# Altium project rffe-microcontroller.PrjPcb
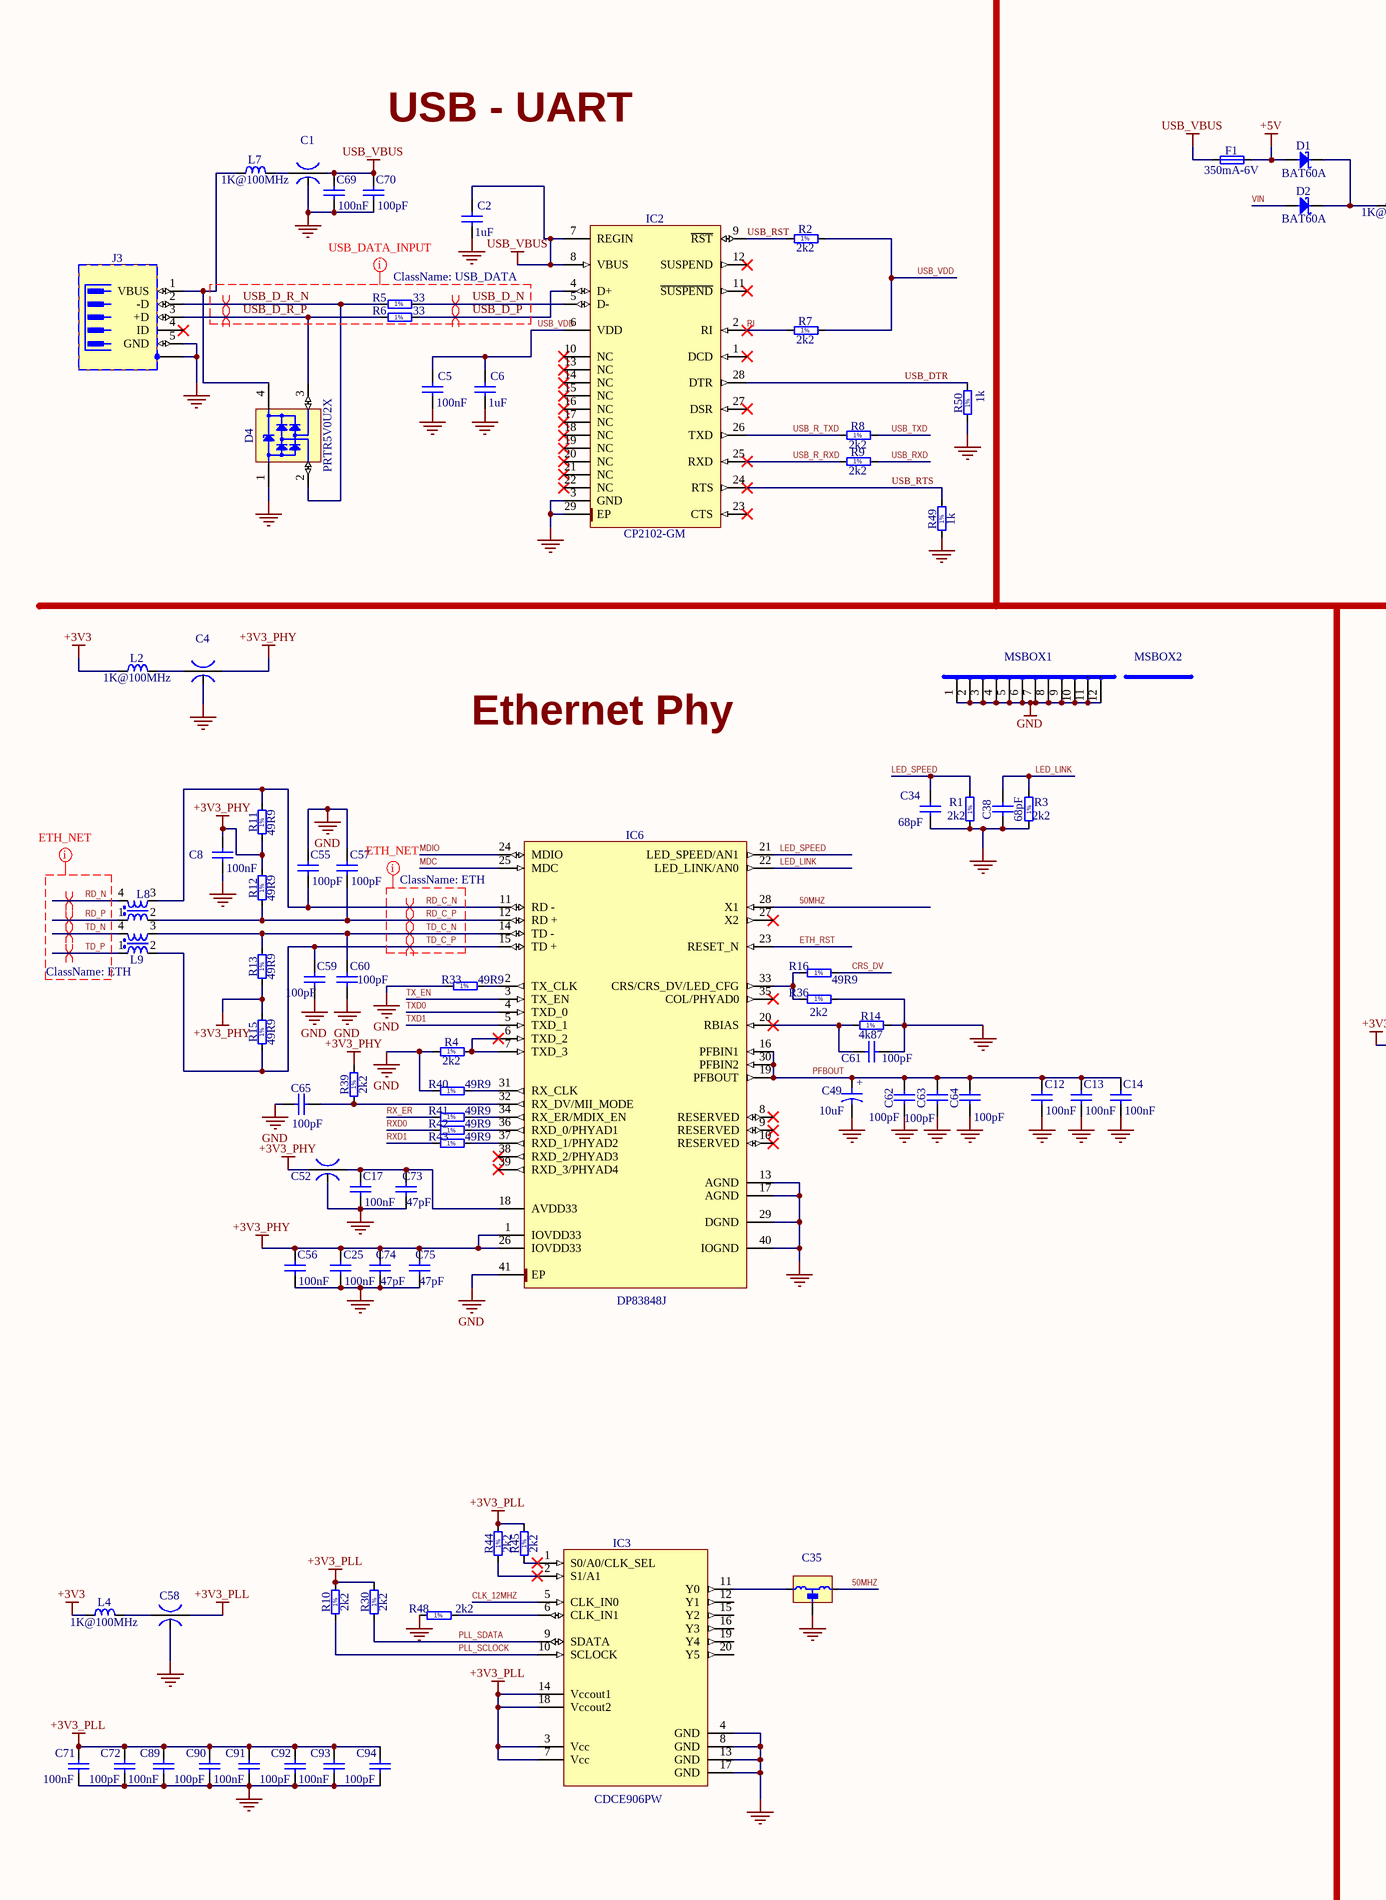
[diagram p0: rffe-microcontroller.SchDoc, left]
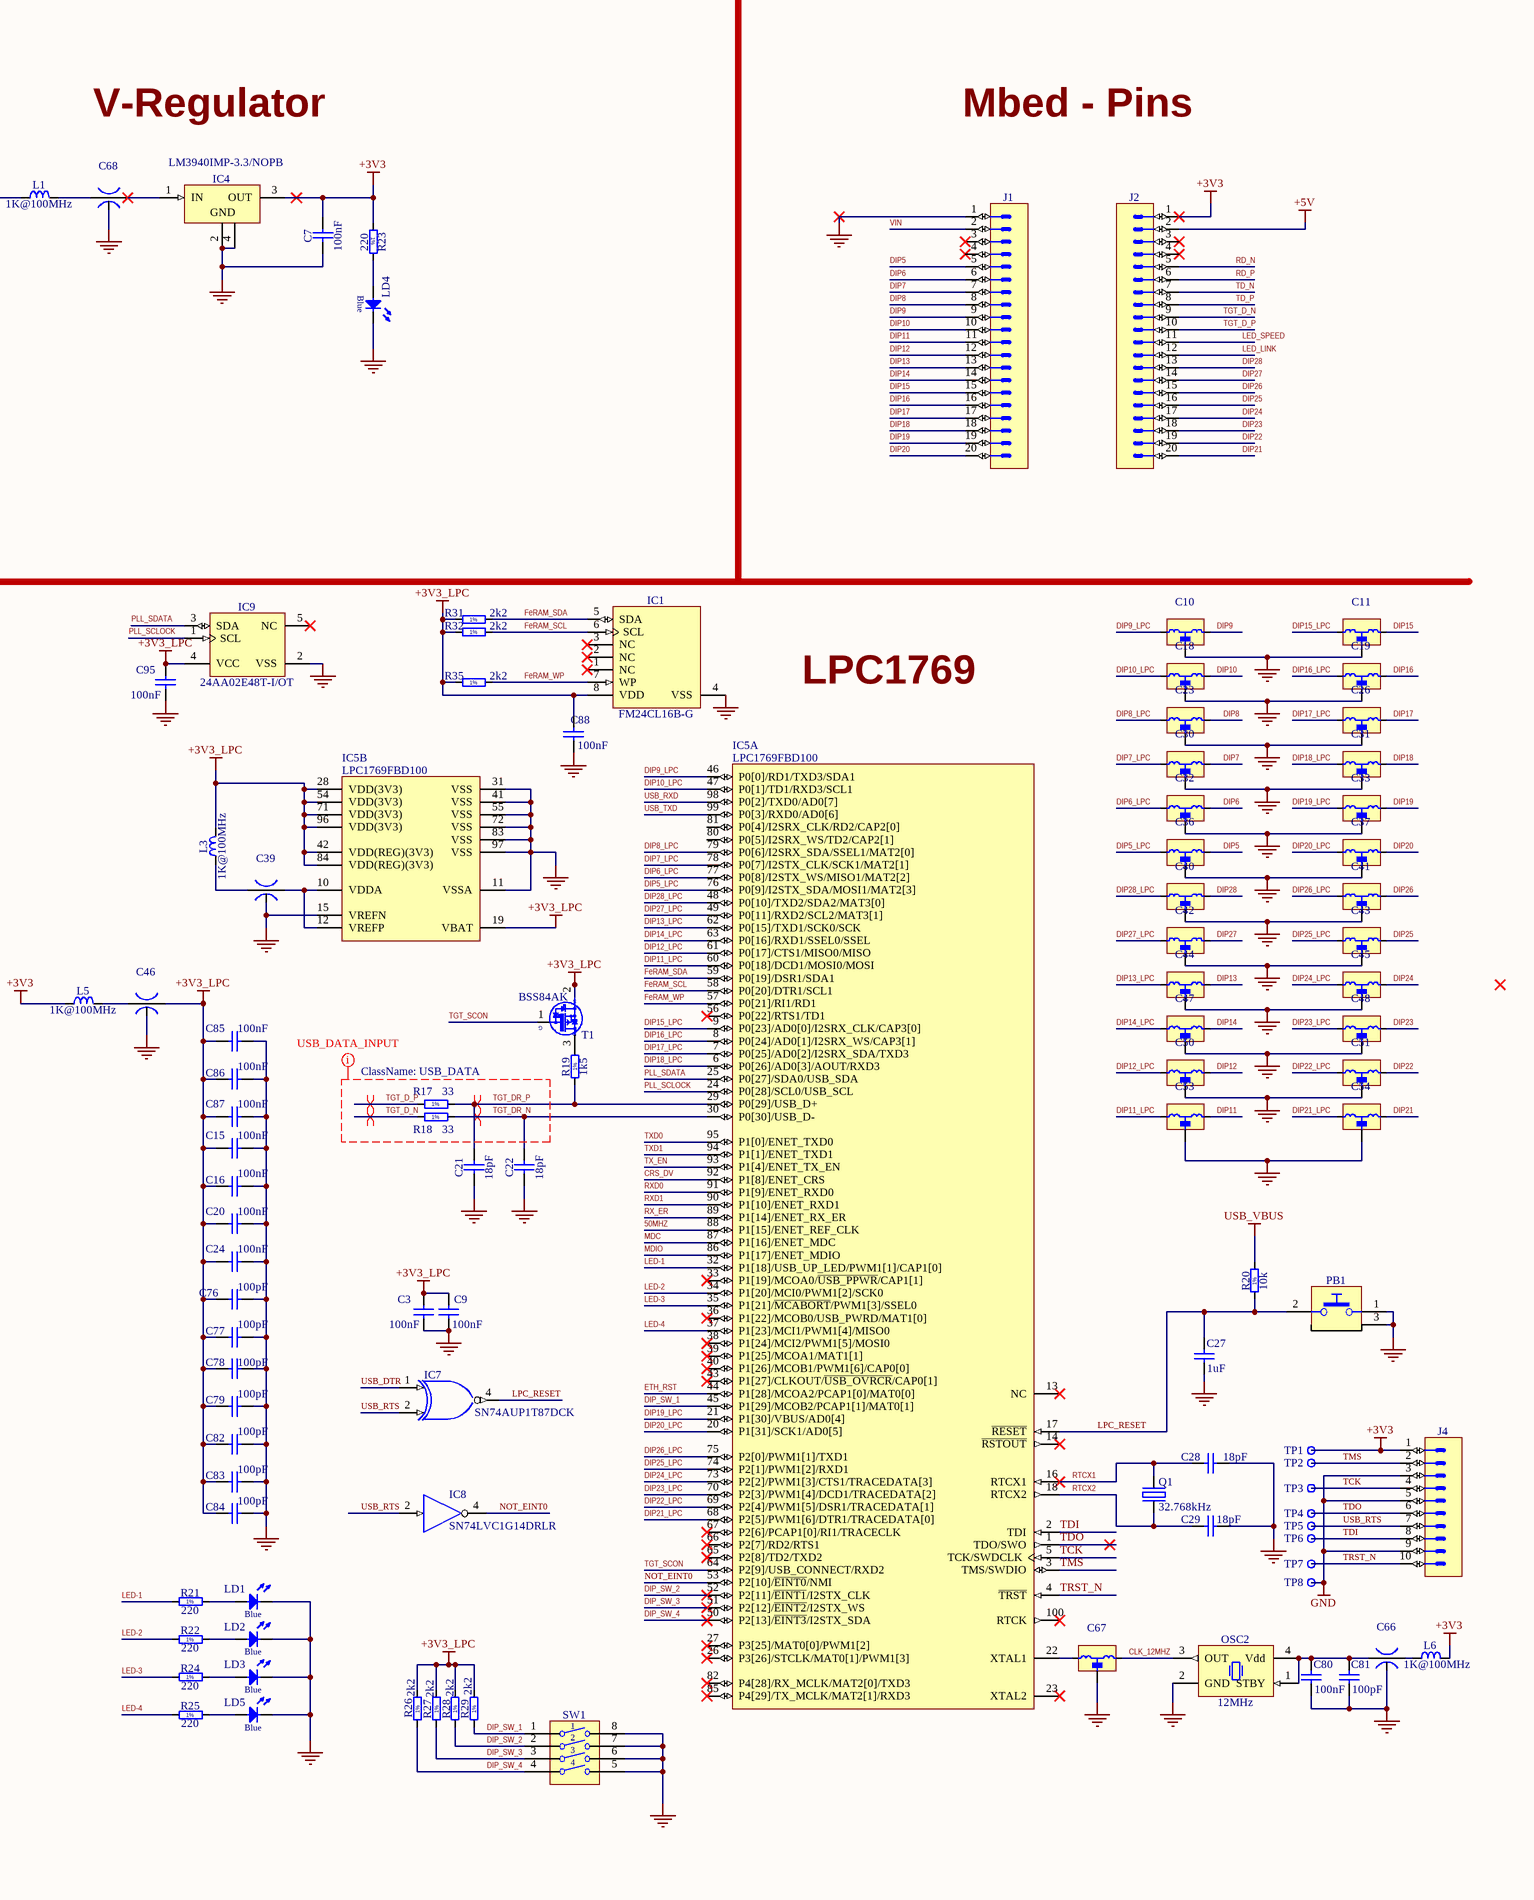
[diagram p1: rffe-microcontroller.SchDoc, right]
ProjectName: RFFE-uc; Revision: 1.1
1 sheet, 186 parts. Net scope: global (net labels, ports and power ports of the same name join across sheets).
Board file: rffe-uc.PcbDoc

## Sheet rffe-microcontroller.SchDoc
size A2; CheckedBy: Aylons; DrawnBy: Luis Fernando Avitia; Revision: 1.2; SheetTotal: 1; ProjectName: RFFE-uc

### Parts
C1  10uF  [CAPC_MURATA_NFM21PS_0805 - TOP_OVERLAY_MENOR]  (value not drawn)
C2  1uF  [CAPC1005X55N]
C3  100nF  [CAPC1005X55N]
C4  10uF  [CAPC_MURATA_NFM21PS_0805 - TOP_OVERLAY_MENOR]  (value not drawn)
C5  100nF  [CAPC1005X55N]
C6  1uF  [CAPC1005X55N]
C7  100nF  [CAPC1005X55N]
C8  100nF  [CAPC1005X55N]
C9  100nF  [CAPC1005X55N]
C10  50pF  [CAPC_MURATA_NFL18ST_UNPOLARIZED]  (value not drawn)
C11  50pF  [CAPC_MURATA_NFL18ST_UNPOLARIZED]  (value not drawn)
C12  100nF  [CAPC1005X55N]
C13  100nF  [CAPC1005X55N]
C14  100nF  [CAPC1005X55N]
C15  100nF  [CAPC1005X55N]
C16  100nF  [CAPC1005X55N]
C17  100nF  [CAPC1005X55N]
C18  50pF  [CAPC_MURATA_NFL18ST_UNPOLARIZED]  (value not drawn)
C19  50pF  [CAPC_MURATA_NFL18ST_UNPOLARIZED]  (value not drawn)
C20  100nF  [CAPC1005X55N]
C21  18pF  [CAPC1005X55N]
C22  18pF  [CAPC1005X55N]
C23  50pF  [CAPC_MURATA_NFL18ST_UNPOLARIZED]  (value not drawn)
C24  100nF  [CAPC1005X55N]
C25  100nF  [CAPC1005X55N]
C26  50pF  [CAPC_MURATA_NFL18ST_UNPOLARIZED]  (value not drawn)
C27  1uF  [CAPC1005X55N]
C28  18pF  [CAPC1005X55N]
C29  18pF  [CAPC1005X55N]
C30  50pF  [CAPC_MURATA_NFL18ST_UNPOLARIZED]  (value not drawn)
C31  50pF  [CAPC_MURATA_NFL18ST_UNPOLARIZED]  (value not drawn)
C32  50pF  [CAPC_MURATA_NFL18ST_UNPOLARIZED]  (value not drawn)
C33  50pF  [CAPC_MURATA_NFL18ST_UNPOLARIZED]  (value not drawn)
C34  68pF  [CAPC1005X55N]
C35  50pF  [CAPC_MURATA_NFL18ST_UNPOLARIZED]  (value not drawn)
C36  50pF  [CAPC_MURATA_NFL18ST_UNPOLARIZED]  (value not drawn)
C37  50pF  [CAPC_MURATA_NFL18ST_UNPOLARIZED]  (value not drawn)
C38  68pF  [CAPC1005X55N]
C39  10uF  [CAPC_MURATA_NFM21PS_0805 - TOP_OVERLAY_MENOR]  (value not drawn)
C40  50pF  [CAPC_MURATA_NFL18ST_UNPOLARIZED]  (value not drawn)
C41  50pF  [CAPC_MURATA_NFL18ST_UNPOLARIZED]  (value not drawn)
C42  50pF  [CAPC_MURATA_NFL18ST_UNPOLARIZED]  (value not drawn)
C43  50pF  [CAPC_MURATA_NFL18ST_UNPOLARIZED]  (value not drawn)
C44  50pF  [CAPC_MURATA_NFL18ST_UNPOLARIZED]  (value not drawn)
C45  50pF  [CAPC_MURATA_NFL18ST_UNPOLARIZED]  (value not drawn)
C46  10uF  [CAPC_MURATA_NFM21PS_0805 - TOP_OVERLAY_MENOR]  (value not drawn)
C47  50pF  [CAPC_MURATA_NFL18ST_UNPOLARIZED]  (value not drawn)
C48  50pF  [CAPC_MURATA_NFL18ST_UNPOLARIZED]  (value not drawn)
C49  10uF  [CAPMP3216X180N]
C50  50pF  [CAPC_MURATA_NFL18ST_UNPOLARIZED]  (value not drawn)
C51  50pF  [CAPC_MURATA_NFL18ST_UNPOLARIZED]  (value not drawn)
C52  10uF  [CAPC_MURATA_NFM21PS_0805 - TOP_OVERLAY_MENOR]  (value not drawn)
C53  50pF  [CAPC_MURATA_NFL18ST_UNPOLARIZED]  (value not drawn)
C54  50pF  [CAPC_MURATA_NFL18ST_UNPOLARIZED]  (value not drawn)
C55  100pF  [CAPC1005X55N]
C56  100nF  [CAPC1005X55N]
C57  100pF  [CAPC1005X55N]
C58  1uF  [CAPC_MURATA_NFM18PS_0603]  (value not drawn)
C59  100pF  [CAPC1005X55N]
C60  100pF  [CAPC1005X55N]
C61  100pF  [CAPC1005X55N]
C62  100pF  [CAPC1005X55N]
C63  100pF  [CAPC1005X55N]
C64  100pF  [CAPC1005X55N]
C65  100pF  [CAPC1005X55N]
C66  10uF  [CAPC_MURATA_NFM21PS_0805 - TOP_OVERLAY_MENOR]  (value not drawn)
C67  50pF  [CAPC_MURATA_NFL18ST_UNPOLARIZED]  (value not drawn)
C68  10uF  [CAPC_MURATA_NFM21PS_0805 - TOP_OVERLAY_MENOR]  (value not drawn)
C69  100nF  [CAPC1005X55N]
C70  100pF  [CAPC1005X55N]
C71  100nF  [CAPC1005X55N]
C72  100pF  [CAPC1005X55N]
C73  47pF  [CAPC1005X55N]
C74  47pF  [CAPC1005X55N]
C75  47pF  [CAPC1005X55N]
C76  100pF  [CAPC1005X55N]
C77  100pF  [CAPC1005X55N]
C78  100pF  [CAPC1005X55N]
C79  100pF  [CAPC1005X55N]
C80  100nF  [CAPC1005X55N]
C81  100pF  [CAPC1005X55N]
C82  100pF  [CAPC1005X55N]
C83  100pF  [CAPC1005X55N]
C84  100pF  [CAPC1005X55N]
C85  100nF  [CAPC1005X55N]
C86  100nF  [CAPC1005X55N]
C87  100nF  [CAPC1005X55N]
C88  100nF  [CAPC1005X55N]
C89  100nF  [CAPC1005X55N]
C90  100pF  [CAPC1005X55N]
C91  100nF  [CAPC1005X55N]
C92  100pF  [CAPC1005X55N]
C93  100nF  [CAPC1005X55N]
C94  100pF  [CAPC1005X55N]
C95  100nF  [CAPC1005X55N]
D1  BAT60A  [SOD2512X110N]
D2  BAT60A  [SOD2512X110N]
D4  PRTR5V0U2X  [SOT190P230X110-4N]
F1  350mA-6V  [FUSR_LITTELFUSE_0603L010]
IC1  FM24CL16B-G  [SOIC127P600X175-8N]
IC2  CP2102-GM  [QFN50P500X500X100-29N-S335]
IC3  CDCE906PW  [SOP65P640X120-20N]
IC4  LM3940IMP-3.3/NOPB  [SOT230P700X180-4N]
IC5  LPC1769FBD100  [QFP50P1600X1600X160-100N]  (parts A,B of 2)
IC6  DP83848J  [QFN50P600X600X80-41N-S460_S/VIAS]
IC7  SN74AUP1T87DCK  [SOT65P210X110-5N]
IC8  SN74LVC1G14DRLR  [SOTFL50P160X60-5N]
IC9  24AA02E48T-I/OT  [SOT95P280X145-5N]
J1  (no value)  [TYCO_2-87224-0]
J2  (no value)  [TYCO_2-87224-0]
J3  (no value)  [HIROSE-ZX62D-AB-5P8(30)]
J4  (no value)  [SAMTEC_FTSH-105-01-L-DV-K]
L1  1K@100MHz  [INDC1608X95N]
L2  1K@100MHz  [INDC1608X95N]
L3  1K@100MHz  [INDC1608X95N]
L4  1K@100MHz  [INDC1608X95N]
L5  1K@100MHz  [INDC1608X95N]
L6  1K@100MHz  [INDC1608X95N]
L7  1K@100MHz  [INDC1608X95N]
L8  200uH  [IND_MURATA_DLW43MH]  (value not drawn)
L9  200uH  [IND_MURATA_DLW43MH]  (value not drawn)
LD1  (no value)  [LED_LITEON_LTST-C150TBKT]
LD2  (no value)  [LED_LITEON_LTST-C150TBKT]
LD3  (no value)  [LED_LITEON_LTST-C150TBKT]
LD4  (no value)  [LED_LITEON_LTST-C150TBKT]
LD5  (no value)  [LED_LITEON_LTST-C150TBKT]
MSBOX1  (no value)  [MSBOX_WURTH_36103205]
MSBOX2  (no value)  [MSBOX_WURTH_36003200]
OSC2  12MHz  [XTAL_CONNOR_CS_LNLS]
PB1  (no value)  [PB_OMRON_B3U-1100P]
Q1  32.768kHz  [XTAL_ABRACON_ABS06]
R1  2k2  [RESC1005X40N]
R2  2k2  [RESC1005X40N]
R3  2k2  [RESC1005X40N]
R4  2k2  [RESC1005X40N]
R5  33  [RESC1005X40N]
R6  33  [RESC1005X40N]
R7  2k2  [RESC1005X40N]
R8  2k2  [RESC1005X40N]
R9  2k2  [RESC1005X40N]
R10  2k2  [RESC1005X40N]
R11  49R9  [RESC1005X40N]
R12  49R9  [RESC1005X40N]
R13  49R9  [RESC1005X40N]
R14  4k87  [RESC1005X40N]
R15  49R9  [RESC1005X40N]
R16  49R9  [RESC1005X40N]
R17  33  [RESC1005X40N]
R18  33  [RESC1005X40N]
R19  1k5  [RESC1005X40N]
R20  10k  [RESC1005X40N]
R21  220  [RESC1005X40N]
R22  220  [RESC1005X40N]
R23  220  [RESC1005X40N]
R24  220  [RESC1005X40N]
R25  220  [RESC1005X40N]
R26  2k2  [RESC1005X40N]
R27  2k2  [RESC1005X40N]
R28  2k2  [RESC1005X40N]
R29  2k2  [RESC1005X40N]
R30  2k2  [RESC1005X40N]
R31  2k2  [RESC1005X40N]
R32  2k2  [RESC1005X40N]
R33  49R9  [RESC1005X40N]
R35  2k2  [RESC1005X40N]
R36  2k2  [RESC1005X40N]
R39  2k2  [RESC1005X40N]
R40  49R9  [RESC1005X40N]
R41  49R9  [RESC1005X40N]
R42  49R9  [RESC1005X40N]
R43  49R9  [RESC1005X40N]
R44  2k2  [RESC1005X40N]
R45  2k2  [RESC1005X40N]
R48  2k2  [RESC1005X40N]
R49  1k  [RESC1005X40N]
R50  1k  [RESC1005X40N]
SW1  (no value)  [SW_TYCO_1571983-4]
T1  BSS84AK  [SOT95P230X110-3N]
TP1  (no value)  [TPR120]
TP2  (no value)  [TPR120]
TP3  (no value)  [TPR120]
TP4  (no value)  [TPR120]
TP5  (no value)  [TPR120]
TP6  (no value)  [TPR120]
TP7  (no value)  [TPR120]
TP8  (no value)  [TPR120]

### Nets
+3V3: C7.2 IC4.3(OUT) J2.1 J4.1 L2.1 L4.1 L5.1 L6.2 R23.1 TP1.1
+3V3_LPC: C3.1 C9.1 C15.1 C16.1 C20.1 C24.1 C46.3 C76.2 C77.2 C78.2 C79.2 C82.2 C83.2 C84.2 C85.1 C86.1 C87.1 C88.2 C95.1 IC1.8(VDD) IC5.19(VBAT) IC5.28(VDD(3V3)) IC5.42(VDD(REG)(3V3)) IC5.54(VDD(3V3)) IC5.71(VDD(3V3)) IC5.84(VDD(REG)(3V3)) IC5.96(VDD(3V3)) IC7.5(+3V3_LPC) IC8.5(VCC) IC9.4(VCC) L3.2 R26.2 R27.2 R28.2 R29.2 R31.1 R32.1 R35.1 T1.2(S)
+3V3_PHY: C4.3 C8.1 C25.1 C52.1 C56.1 C74.2 C75.2 IC6.1(IOVDD33) IC6.26(IOVDD33) R11.1 R12.2 R13.1 R15.2 R39.2
+3V3_PLL: C58.1 C71.1 C72.2 C89.1 C90.2 C91.1 C92.2 C93.1 C94.2 IC3.3(Vcc) IC3.7(Vcc) IC3.14(Vccout1) IC3.18(Vccout2) R10.2 R30.2 R44.2 R45.2
+5V: D1.2(A) F1.2 J2.2
GND: C1.2 C2.1 C3.2 C4.2 C5.2 C6.1 C7.1 C8.2 C9.2 C10.2 C11.2 C12.2 C13.2 C14.2 C15.2 C16.2 C17.2 C18.2 C19.2 C20.2 C21.1 C22.1 C23.2 C24.2 C25.2 C26.2 C27.2 C28.2 C29.2 C30.2 C31.2 C32.2 C33.2 C34.1 C35.2 C36.2 C37.2 C38.1 C39.2 C40.2 C41.2 C42.2 C43.2 C44.2 C45.2 C46.2 C47.2 C48.2 C49.2 C50.2 C51.2 C52.2 C53.2 C54.2 C55.2 C56.2 C57.2 C58.2 C59.1 C60.1 C61.2 C62.1 C63.1 C64.1 C65.1 C66.2 C67.2 C68.2 C69.2 C70.1 C71.2 C72.1 C73.1 C74.1 C75.1 C76.1 C77.1 C78.1 C79.1 C80.2 C81.1 C82.1 C83.1 C84.1 C85.2 C86.2 C87.2 C88.1 C89.2 C90.1 C91.2 C92.1 C93.2 C94.1 C95.2 D4.1(GND) IC1.4(VSS) IC2.3(GND) IC2.29(EP) IC3.4(GND) IC3.8(GND) IC3.13(GND) IC3.17(GND) IC4.2(GND) IC4.4(GND) IC5.11(VSSA) IC5.15(VREFN) IC5.31(VSS) IC5.41(VSS) IC5.55(VSS) IC5.72(VSS) IC5.83(VSS) IC5.97(VSS) IC6.13(AGND) IC6.17(AGND) IC6.29(DGND) IC6.40(IOGND) IC6.41(EP) IC7.3(GND) IC8.3(GND) IC9.2(VSS) J1.1 J3.5(GND) J3.6(SH) J4.3 J4.5 J4.9 LD1.1(C) LD2.1(C) LD3.1(C) LD4.1(C) LD5.1(C) MSBOX1.1 MSBOX1.2 MSBOX1.3 MSBOX1.4 MSBOX1.5 MSBOX1.6 MSBOX1.7 MSBOX1.8 MSBOX1.9 MSBOX1.10 MSBOX1.11 MSBOX1.12 OSC2.2(GND) PB1.1 PB1.3 R1.1 R3.1 R4.1 R14.2 R33.1 R36.2 R40.1 R48.1 R49.1 R50.1 SW1.5 SW1.6 SW1.7 SW1.8 TP8.1
USB_VBUS: C1.3 C2.2 C69.1 C70.2 F1.1 IC2.7(REGIN) IC2.8(VBUS) R20.2
50MHZ: C35.3 IC5.88(P1[15]/ENET_REF_CLK) IC6.28(X1)
CLK_12MHZ: C67.3 IC3.5(CLK_IN0) OSC2.3(OUT)
CRS_DV: IC5.92(P1[8]/ENET_CRS) R16.2
DIP5: C36.3 J1.5
DIP5_LPC: C36.1 IC5.76(P0[9]/I2STX_SDA/MOSI1/MAT2[3])
DIP6: C32.3 J1.6
DIP6_LPC: C32.1 IC5.77(P0[8]/I2STX_WS/MISO1/MAT2[2])
DIP7: C30.3 J1.7
DIP7_LPC: C30.1 IC5.78(P0[7]/I2STX_CLK/SCK1/MAT2[1])
DIP8: C23.3 J1.8
DIP8_LPC: C23.1 IC5.79(P0[6]/I2SRX_SDA/SSEL1/MAT2[0])
DIP9: C10.3 J1.9
DIP9_LPC: C10.1 IC5.46(P0[0]/RD1/TXD3/SDA1)
DIP10: C18.3 J1.10
DIP10_LPC: C18.1 IC5.47(P0[1]/TD1/RXD3/SCL1)
DIP11: C53.3 J1.11
DIP11_LPC: C53.1 IC5.60(P0[18]/DCD1/MOSI0/MOSI)
DIP12: C50.3 J1.12
DIP12_LPC: C50.1 IC5.61(P0[17]/CTS1/MISO0/MISO)
DIP13: C44.3 J1.13
DIP13_LPC: C44.1 IC5.62(P0[15]/TXD1/SCK0/SCK)
DIP14: C47.3 J1.14
DIP14_LPC: C47.1 IC5.63(P0[16]/RXD1/SSEL0/SSEL)
DIP15: C11.3 J1.15
DIP15_LPC: C11.1 IC5.9(P0[23]/AD0[0]/I2SRX_CLK/CAP3[0])
DIP16: C19.3 J1.16
DIP16_LPC: C19.1 IC5.8(P0[24]/AD0[1]/I2SRX_WS/CAP3[1])
DIP17: C26.3 J1.17
DIP17_LPC: C26.1 IC5.7(P0[25]/AD0[2]/I2SRX_SDA/TXD3)
DIP18: C31.3 J1.18
DIP18_LPC: C31.1 IC5.6(P0[26]/AD0[3]/AOUT/RXD3)
DIP19: C33.3 J1.19
DIP19_LPC: C33.1 IC5.21(P1[30]/VBUS/AD0[4])
DIP20: C37.3 J1.20
DIP20_LPC: C37.1 IC5.20(P1[31]/SCK1/AD0[5])
DIP21: C54.3 J2.20
DIP21_LPC: C54.1 IC5.68(P2[5]/PWM1[6]/DTR1/TRACEDATA[0])
DIP22: C51.3 J2.19
DIP22_LPC: C51.1 IC5.69(P2[4]/PWM1[5]/DSR1/TRACEDATA[1])
DIP23: C48.3 J2.18
DIP23_LPC: C48.1 IC5.70(P2[3]/PWM1[4]/DCD1/TRACEDATA[2])
DIP24: C45.3 J2.17
DIP24_LPC: C45.1 IC5.73(P2[2]/PWM1[3]/CTS1/TRACEDATA[3])
DIP25: C43.3 J2.16
DIP25_LPC: C43.1 IC5.74(P2[1]/PWM1[2]/RXD1)
DIP26: C41.3 J2.15
DIP26_LPC: C41.1 IC5.75(P2[0]/PWM1[1]/TXD1)
DIP27: C42.3 J2.14
DIP27_LPC: C42.1 IC5.49(P0[11]/RXD2/SCL2/MAT3[1])
DIP28: C40.3 J2.13
DIP28_LPC: C40.1 IC5.48(P0[10]/TXD2/SDA2/MAT3[0])
DIP_SW_1: IC5.45(P1[29]/MCOB2/PCAP1[1]/MAT0[1]) R29.1 SW1.1
DIP_SW_2: IC5.52(P2[11]/~{EINT1}/I2STX_CLK) R28.1 SW1.2
DIP_SW_3: IC5.51(P2[12]/~{EINT2}/I2STX_WS) R27.1 SW1.3
DIP_SW_4: IC5.50(P2[13]/~{EINT3}/I2STX_SDA) R26.1 SW1.4
ETH_RST: IC5.44(P1[28]/MCOA2/PCAP1[0]/MAT0[0]) IC6.23(RESET_N)
FeRAM_SCL: IC1.6(SCL) IC5.58(P0[20]/DTR1/SCL1) R32.2
FeRAM_SDA: IC1.5(SDA) IC5.59(P0[19]/DSR1/SDA1) R31.2
FeRAM_WP: IC1.7(WP) IC5.57(P0[21]/RI1/RD1) R35.2
LED-1: IC5.32(P1[18]/USB_UP_LED/PWM1[1]/CAP1[0]) R21.1
LED-2: IC5.34(P1[20]/MCI0/PWM1[2]/SCK0) R22.1
LED-3: IC5.35(P1[21]/~{MCABORT}/PWM1[3]/SSEL0) R24.1
LED-4: IC5.37(P1[23]/MCI1/PWM1[4]/MISO0) R25.1
LED_LINK: C38.2 IC6.22(LED_LINK/AN0) J2.12 R3.2
LED_SPEED: C34.2 IC6.21(LED_SPEED/AN1) J2.11 R1.2
LPC_RESET: C27.1 IC5.17(~{RESET}) IC7.4(Y) PB1.2 R20.1
MDC: IC5.87(P1[16]/ENET_MDC) IC6.25(MDC)
MDIO: IC5.86(P1[17]/ENET_MDIO) IC6.24(MDIO)
NOT_EINT0: IC5.53(P2[10]/~{EINT0}/NMI) IC8.4(OUT)
PFBOUT: C12.1 C13.1 C14.1 C49.1 C62.2 C63.2 C64.2 IC6.16(PFBIN1) IC6.19(PFBOUT) IC6.30(PFBIN2)
PLL_SCLOCK: IC3.10(SCLOCK) IC5.24(P0[28]/SCL0/USB_SCL) IC9.1(SCL) R10.1
PLL_SDATA: IC3.9(SDATA) IC5.25(P0[27]/SDA0/USB_SDA) IC9.3(SDA) R30.1
RD_C_N: C55.1 IC6.11(RD_-) L8.3 R11.2
RD_C_P: C57.1 IC6.12(RD_+) L8.2 R12.1
RD_N: J2.5 L8.4
RD_P: J2.6 L8.1
RI: IC2.2(RI) R7.1
RTCX1: C28.1 IC5.16(RTCX1) Q1.2(OSC2)
RTCX2: C29.1 IC5.18(RTCX2) Q1.1(OSC1)
RX_ER: IC5.89(P1[14]/ENET_RX_ER) R41.1
RXD0: IC5.91(P1[9]/ENET_RXD0) R42.1
RXD1: IC5.90(P1[10]/ENET_RXD1) R43.1
TCK: IC5.5(TCK/SWDCLK) J4.4 TP3.1
TD_C_N: C60.2 IC6.14(TD_-) L9.3 R13.2
TD_C_P: C59.2 IC6.15(TD_+) L9.2 R15.1
TD_N: J2.7 L9.4
TD_P: J2.8 L9.1
TDI: IC5.2(TDI) J4.8 TP6.1
TDO: IC5.1(TDO/SWO) J4.6 TP4.1
TGT_D_N: J2.9 R18.1
TGT_D_P: J2.10 R17.1
TGT_DR_N: C22.2 IC5.30(P0[30]/USB_D-) R18.2
TGT_DR_P: C21.2 IC5.29(P0[29]/USB_D+) R17.2 R19.1
TGT_SCON: IC5.64(P2[9]/USB_CONNECT/RXD2) T1.1(G)
TMS: IC5.3(TMS/SWDIO) J4.2 TP2.1
TRST_N: IC5.4(~{TRST}) J4.10 TP7.1
TX_EN: IC5.93(P1[4]/ENET_TX_EN) IC6.3(TX_EN)
TXD0: IC5.95(P1[0]/ENET_TXD0) IC6.4(TXD_0)
TXD1: IC5.94(P1[1]/ENET_TXD1) IC6.5(TXD_1)
USB_D_N: IC2.5(D-) R5.2
USB_D_P: IC2.4(D+) R6.2
USB_D_R_N: D4.2(I/O1) J3.2(-D) R5.1
USB_D_R_P: D4.3(I/O2) J3.3(+D) R6.1
USB_DTR: IC2.28(DTR) IC7.1(A) R50.2
USB_R_RXD: IC2.25(RXD) R9.1
USB_R_TXD: IC2.26(TXD) R8.1
USB_RST: IC2.9(~{RST}) R2.1
USB_RTS: IC2.24(RTS) IC7.2(B) IC8.2(IN) J4.7 R49.2 TP5.1
USB_RXD: IC5.98(P0[2]/TXD0/AD0[7]) R9.2
USB_TXD: IC5.99(P0[3]/RXD0/AD0[6]) R8.2
USB_VDD: C5.1 C6.2 IC2.6(VDD) R2.2 R7.2
VIN: D2.2(A) J1.2
NetC1_1: C1.1 L7.2
NetC4_1: C4.1 L2.2
NetC17_1: C17.1 C52.3 C73.2 IC6.18(AVDD33)
NetC35_1: C35.1 IC3.11(Y0)
NetC39_1: C39.1 L3.1
NetC39_3: C39.3 IC5.10(VDDA) IC5.12(VREFP)
NetC46_1: C46.1 L5.2
NetC58_3: C58.3 L4.2
NetC61_1: C61.1 IC6.20(RBIAS) R14.1
NetC65_2: C65.2 IC6.32(RX_DV/MII_MODE) R39.1
NetC66_1: C66.1 C80.1 C81.2 OSC2.1(STBY) OSC2.4(Vdd)
NetC66_3: C66.3 L6.1
NetC67_1: C67.1 IC5.22(XTAL1)
NetC68_1: C68.1 L1.2
NetC68_3: C68.3 IC4.1(IN)
NetD1_1: D1.1(C) D2.1(C) L1.1
NetD4_4: D4.4(VCC) J3.1(VBUS) L7.1
NetIC3_1: IC3.1(S0/A0/CLK_SEL) R45.1
NetIC3_2: IC3.2(S1/A1) R44.1
NetIC3_6: IC3.6(CLK_IN1) R48.2
NetIC6_2: IC6.2(TX_CLK) R33.2
NetIC6_6: IC6.6(TXD_2) IC6.7(TXD_3) R4.2
NetIC6_31: IC6.31(RX_CLK) R40.2
NetIC6_33: IC6.33(CRS/CRS_DV/LED_CFG) R16.1 R36.1
NetIC6_34: IC6.34(RX_ER/MDIX_EN) R41.2
NetIC6_36: IC6.36(RXD_0/PHYAD1) R42.2
NetIC6_37: IC6.37(RXD_1/PHYAD2) R43.2
NetLD1_2: LD1.2(A) R21.2
NetLD2_2: LD2.2(A) R22.2
NetLD3_2: LD3.2(A) R24.2
NetLD4_2: LD4.2(A) R23.2
NetLD5_2: LD5.2(A) R25.2
NetR19_2: R19.2 T1.3(D)

Not connected (* = marked no-connect by the designer): IC1 1(NC)* 2(NC)* 3(NC)*; IC2 1(DCD)* 10(NC)* 11(~{SUSPEND})* 12(SUSPEND)* 13(NC)* 14(NC)* 15(NC)* 16(NC)* 17(NC)* 18(NC)* 19(NC)* 20(NC)* 21(NC)* 22(NC)* 23(CTS)* 27(DSR)*; IC3 12(Y1) 15(Y2) 16(Y3) 19(Y4) 20(Y5); IC5 13(NC)* 14(~{RSTOUT})* 23(XTAL2)* 26(P3[26]/STCLK/MAT0[1]/PWM1[3])* 27(P3[25]/MAT0[0]/PWM1[2])* 33(P1[19]/MCOA0/~{USB_PPWR}/CAP1[1])* 36(P1[22]/MCOB0/USB_PWRD/MAT1[0])* 38(P1[24]/MCI2/PWM1[5]/MOSI0)* 39(P1[25]/MCOA1/MAT1[1])* 40(P1[26]/MCOB1/PWM1[6]/CAP0[0])* 43(P1[27]/CLKOUT/~{USB_OVRCR}/CAP0[1])* 56(P0[22]/RTS1/TD1)* 65(P2[8]/TD2/TXD2)* 66(P2[7]/RD2/RTS1)* 67(P2[6]/PCAP1[0]/RI1/TRACECLK)* 80(P0[5]/I2SRX_WS/TD2/CAP2[1]) 81(P0[4]/I2SRX_CLK/RD2/CAP2[0]) 82(P4[28]/RX_MCLK/MAT2[0]/TXD3)* 85(P4[29]/TX_MCLK/MAT2[1]/RXD3)* 100(RTCK)*; IC6 8(RESERVED)* 9(RESERVED)* 10(RESERVED)* 27(X2)* 35(COL/PHYAD0)* 38(RXD_2/PHYAD3)* 39(RXD_3/PHYAD4)*; IC9 5(NC)*; J1 3* 4*; J2 3* 4*; J3 4(ID)*

### Layout directives
differential pair: RD_C_N, RD_C_P, RD_N, RD_P, TD_C_N, TD_C_P, TD_N, TD_P, TGT_D_N, TGT_D_P, TGT_DR_N, TGT_DR_P, USB_D_N, USB_D_P, USB_D_R_N, USB_D_R_P
net class USB_DATA: TGT_D_N, TGT_D_P, TGT_DR_N, TGT_DR_P, USB_D_N, USB_D_P, USB_D_R_N, USB_D_R_P
net class ETH: RD_C_N, RD_C_P, RD_N, RD_P, TD_C_N, TD_C_P, TD_N, TD_P

### Notes on the sheet
- USB - UART
- V-Regulator
- Mbed - Pins
- Ethernet Phy
- LPC1769
- Title:
- Date:
- Project:
- Drawn by:
- Time:
- Version:
- Sheet
- Reviewed by:
- of
- Grupo de diagnóstico do feixe -
  DIG - LNLS
- File:
- Copyright CNPEM 2020.
  This source describes Open Hardware and is licensed under the CERN-OHL-S v2
  You may redistribute and modify this documentation and make products using it under the terms of the CERN-OHL-S v2 (https:/cern.ch/cern-ohl). This documentation is distributed WITHOUT ANY EXPRESS OR IMPLIED WARRANTY, INCLUDING OF MERCHANTABILITY, SATISFACTORY QUALITY AND FITNESS FOR A PARTICULAR PURPOSE. Please see the CERN-OHL-S v2 for applicable conditions.
- (in symbol CTE3216-18_10UF_16V_20%_AVX_TCJ) +
- (in symbol R0402_1K5_1%_0.0625W_100PPM) 1%
- (in symbol R0402_1K_1%_0.0625W_100PPM) 1%
- (in symbol R0402_2K2_1%_0.0625W_100PPM) 1%
- (in symbol R0402_4K87_1%_0.0625W_100PPM) 1%
- (in symbol R0402_10K_1%_0.0625W_100PPM) 1%
- (in symbol R0402_33R_1%_0.0625W_100PPM) 1%
- (in symbol R0402_49R9_1%_0.0625W_100PPM) 1%
- (in symbol R0402_220R_1%_0.0625W_100PPM) 1%

### Library data of the parts
C1 C4 C39 C46 C52 C66 C68 = CEMIF_10UF_6.3V_MURATA_NFM21PS106B0J3D_TOP_OVERLAY_MENOR: EMI Filter - Capacitor Type 1; Part Description: 4A EMI Filter Capacitor Type, NFM21PS Series (0805 Size); Manufacturer: MURATA; Voltage: 6.3V; Tolerance: ±20%; Part Number: CEMIF_10UF_6.3V_MURATA_NFM21PS106B0J3D_TOP_OVERLAY_MENOR; Component Kind: Standard; Component Type: Standard; Pin Count: 4; Value: 10uF; Status: None; Manufacturer Part Number: NFM21PS106B0J3D; Case: 0805; Mounted: Yes; Socket: No; SMD: Yes; Sense: No; ComponentHeight: 0.85; Author: LNLS DIG LOS; CreateDate: 04/12/2017; LatestRevisionDate: 04/12/2017
C2 C6 C27 = CC0402_1UF_16V_10%_X5R: Non-polarised capacitor; Part Description: SMD Multilayer Chip Ceramic Capacitor; Manufacturer: GENERIC; Manufacturer1 Part Number: C1005X5R1C105KT; Voltage: 16V; TC: X5R; Tolerance: ±10%; Part Number: CC0402_1UF_16V_10%_X5R; Component Kind: Standard; Component Type: Standard; Pin Count: 2; Value: 1uF; Status: Preferred; Manufacturer Part Number: CC0402_1UF_16V_10%_X5R; Case: 0402; Mounted: Yes; Socket: No; SMD: Yes; Sense: No; Manufacturer1 Example: TDK; Manufacturer1 ComponentHeight: 0.55mm; HelpURL: \\cern.ch\dfs\Applications\Altium\Datasheets\CC0402_X5R_TDK_C.pdf; Author: CERN DEM JLC; CreateDate: 25/10/2012; LatestRevisionDate: 25/10/2012
C3 C5 C7-C9 C12-C17 C20 C24 C25 C56 C69 C71 C80 C85-C89 C91 C93 C95 = CC0402_100NF_16V_10%_X5R: Non-polarised capacitor; Part Description: SMD Multilayer Chip Ceramic Capacitor; Manufacturer: GENERIC; Manufacturer1 Part Number: GRM155R61C104KA88D; Voltage: 16V; TC: X5R; Tolerance: ±10%; Part Number: CC0402_100NF_16V_10%_X5R; Component Kind: Standard; Component Type: Standard; Pin Count: 2; Value: 100nF; Status: None; Manufacturer Part Number: CC0402_100NF_16V_10%_X5R; Case: 0402; Mounted: Yes; Socket: No; SMD: Yes; Sense: No; Manufacturer1 Example: MURATA; Manufacturer1 ComponentHeight: 0.55mm; HelpURL: \\cern.ch\dfs\Applications\Altium\Datasheets\CC0402_X5R_MURATA_GRM.pdf; Author: CERN DEM JLC; CreateDate: 10/12/2013; LatestRevisionDate: 10/12/2013
C10 C11 C18 C19 C23 C26 C30-C33 C35-C37 C40-C45 C47 C48 C50 C51 C53 C54 C67 = CEMIF_50pF_10V_MURATA_NFL18ST107H1A3D_UNPOLARIZED: EMI Filter (LC Combined); Part Description: EMI Surface Mount Filter (T-type LC ), NFL18ST Series; Manufacturer: MURATA; Voltage: 10V; Tolerance: +20%; Part Number: CEMIF_50pF_10V_MURATA_NFL18ST107H1A3D_UNPOLARIZED; Component Kind: Standard; Component Type: Standard; Pin Count: 4; Value: 50pF; Status: None; Manufacturer Part Number: NFL18ST107H1A3D; Case: 0603; Mounted: Yes; Socket: No; SMD: Yes; Sense: No; ComponentHeight: 0.70; Author: LNLS DIG LOS; CreateDate: 04/12/2017; LatestRevisionDate: 04/12/2017
C21 C22 C28 C29 = CC0402_18PF_50V_5%_C0G: Non-polarised capacitor; Part Description: SMD Multilayer Chip Ceramic Capacitor; Manufacturer: GENERIC; Manufacturer1 Part Number: C0402C180J5GACTU; Voltage: 50V; TC: C0G/NP0; Tolerance: ±5%; Part Number: CC0402_18PF_50V_5%_C0G; Component Kind: Standard; Component Type: Standard; Pin Count: 2; Value: 18pF; Status: Preferred; Manufacturer Part Number: CC0402_18PF_50V_5%_C0G; Case: 0402; Mounted: Yes; Socket: No; SMD: Yes; Sense: No; Manufacturer1 Example: KEMET; Manufacturer1 ComponentHeight: 0.55mm; HelpURL: \\cern.ch\dfs\Applications\Altium\Datasheets\CC0805_C0G_KEMET_(Commercial Grade).pdf; Author: CERN DEM JLC; CreateDate: 04/10/2016; LatestRevisionDate: 04/10/2016
C34 C38 = CC0402_68PF_50V_5%_C0G: Non-polarised capacitor; Part Description: SMD Multilayer Chip Ceramic Capacitor; Manufacturer: GENERIC; Manufacturer1 Part Number: C0402C680J5GACTU; Voltage: 50V; TC: C0G/NP0; Tolerance: ±5%; Part Number: CC0402_68PF_50V_5%_C0G; Component Kind: Standard; Component Type: Standard; Pin Count: 2; Value: 68pF; Status: Preferred; Manufacturer Part Number: CC0402_68PF_50V_5%_C0G; Case: 0402; Mounted: Yes; Socket: No; SMD: Yes; Sense: No; Manufacturer1 Example: KEMET; Manufacturer1 ComponentHeight: 0.55mm; HelpURL: \\cern.ch\dfs\Applications\Altium\Datasheets\CC0805_C0G_KEMET_(Commercial Grade).pdf; Author: CERN DEM JLC; CreateDate: 03/12/2007; LatestRevisionDate: 22/04/2015
C49 = CTE3216-18_10UF_16V_20%_AVX_TCJ: Polarised capacitor; Part Description: ESR 0R200 Tantalum Solid Electrolytic Chip Capacitor with Conductive Polymer Electrode; Manufacturer: AVX; Manufacturer Part Number: TCJA106M016R0200; Voltage: 16V; Tolerance: ±20%; Part Number: CTE3216-18_10UF_16V_20%_AVX_TCJ; Component Kind: Standard; Component Type: Standard; Pin Count: 2; Value: 10uF; Status: Preferred; Case: A; Mounted: Yes; Socket: No; SMD: Yes; Sense: No; ComponentHeight: 1.8mm; HelpURL: \\cern.ch\dfs\Applications\Altium\Datasheets\CTE_AVX_TCJ.pdf; Author: CERN DEM JLC; CreateDate: 29/03/2012; LatestRevisionDate: 29/03/2012
C55 C57 C59-C65 = CC0402_100pF_50V_2%_C0G_MURATA_GRM1555C1H101GA01: Non-polarised capacitor; Part Description: Chip Multilayer Ceramic Capacitors for General Purpose; Manufacturer: MURATA; Voltage: 50V; TC: C0G; Tolerance: ±2%; Part Number: CC0402_100pF_50V_2%_C0G_MURATA_GRM1555C1H101GA01; Component Kind: Standard; Component Type: Standard; Pin Count: 2; Value: 100pF; Status: None; Manufacturer Part Number: GRM1555C1H101GA01; Case: 0402; Mounted: Yes; Socket: No; SMD: Yes; Sense: No; ComponentHeight: 0.55; Author: LNLS DIG LOS; CreateDate: 19/01/2018; LatestRevisionDate: 19/01/2018
C58 = CEMIF_1UF_6.3V_MURATA_NFM18PS105R0J3: EMI Filter - Capacitor Type 1; Part Description: 2A EMI Filter Capacitor Type, NFM18PS Series (0603 Size); Manufacturer: MURATA; Manufacturer Part Number: NFM18PS105R0J3D; Voltage: 6.3V; Tolerance: ±20%; Part Number: CEMIF_1UF_6.3V_MURATA_NFM18PS105R0J3; Component Kind: Standard; Component Type: Standard; Pin Count: 4; Value: 1uF; Status: None; Case: 0603; Mounted: Yes; Socket: No; SMD: Yes; Sense: No; ComponentHeight: 0.70; Author: LNLS DIG GBMB; CreateDate: 03/11/2017; LatestRevisionDate: 03/11/2017
C70 C72 C76-C79 C81-C84 C90 C92 C94 = CC0402_100PF_50V_5%_C0G: Non-polarised capacitor; Part Description: SMD Multilayer Chip Ceramic Capacitor; Manufacturer: GENERIC; Manufacturer1 Part Number: C0402C101J5GACTU; Voltage: 50V; TC: C0G/NP0; Tolerance: ±5%; Part Number: CC0402_100PF_50V_5%_C0G; Component Kind: Standard; Component Type: Standard; Pin Count: 2; Value: 100pF; Status: Preferred; Manufacturer Part Number: CC0402_100PF_50V_5%_C0G; Case: 0402; Mounted: Yes; Socket: No; SMD: Yes; Sense: No; Manufacturer1 Example: KEMET; Manufacturer1 ComponentHeight: 0.55mm; HelpURL: \\cern.ch\dfs\Applications\Altium\Datasheets\CC0805_C0G_KEMET_(Commercial Grade).pdf; Author: CERN DEM JLC; CreateDate: 03/12/2007; LatestRevisionDate: 22/04/2015
C73-C75 = CC0402_47PF_50V_5%_C0G: Non-polarised capacitor; Part Description: SMD Multilayer Chip Ceramic Capacitor; Manufacturer: GENERIC; Manufacturer1 Part Number: C0402C470J5GACTU; Voltage: 50V; TC: C0G/NP0; Tolerance: ±5%; Part Number: CC0402_47PF_50V_5%_C0G; Component Kind: Standard; Component Type: Standard; Pin Count: 2; Value: 47pF; Status: Preferred; Manufacturer Part Number: CC0402_47PF_50V_5%_C0G; Case: 0402; Mounted: Yes; Socket: No; SMD: Yes; Sense: No; Manufacturer1 Example: KEMET; Manufacturer1 ComponentHeight: 0.55mm; HelpURL: \\cern.ch\dfs\Applications\Altium\Datasheets\CC0805_C0G_KEMET_(Commercial Grade).pdf; Author: CERN DEM JLC; CreateDate: 03/12/2007; LatestRevisionDate: 22/04/2015
D1 D2 = BAT60A: Schottky Diode; Part Description: High Current Schottky Diode; Manufacturer: Infineon; Voltage: 10V; Power: 3A; PressFit: No; Bonding: No; Part Number: BAT60A; Component Kind: Standard; Component Type: Standard; Device: BAT60A; PackageDescription: Small Outline Diode Flat Lead (SOD-323), 1.70mm W X 1.25mm L X 1.10mm H body,  IPC Medium Density; Manufacturer Part Number: BAT60A; Pin Count: 2; Case: SOD323; Mounted: Yes; Socket: No; SMD: Yes; Sense: No; ComponentHeight: 1.1mm; Author: LNLS DIG GBMB; CreateDate: 04/08/2017; LatestRevisionDate: 04/08/2017
D4 = PRTR5V0U2X: Ultra Low Capacitance Double Rail-to-Rail ESD Protection Diode; Part Description: Ultra Low Capacitance (1pF) Double Rail-to-Rail ESD Protection Diode (8kV); Manufacturer: NXP SEMICONDUCTORS; Voltage: 5.5V; PressFit: No; Bonding: No; Part Number: PRTR5V0U2X; Component Kind: Standard; Component Type: Standard; Device: PRTR5V0U2X; PackageDescription: SOT143B, SOT, 1.90mm Pitch; 4 Pin, 1.30mm W X 2.90mm L X 1.10mm H body, IPC Medium Density; Manufacturer Part Number: PRTR5V0U2X; Pin Count: 4; Case: SOT143B; Mounted: Yes; Socket: No; SMD: Yes; Sense: No; ComponentHeight: 1.1mm; HelpURL: \\cern.ch\dfs\Applications\Altium\Datasheets\PRTR5V0U2X.pdf; Author: CERN DEM JLC; CreateDate: 22/03/2011; LatestRevisionDate: 22/03/2011
F1 = FUSR_LITTELFUSE_0603L035: Fuse; Part Description: POLYFUSE® Surface Mount Resettable PTC; PressFit: No; Part Number: FUSR_LITTELFUSE_0603L035; Component Kind: Standard; Component Type: Standard; Pin Count: 2; PackageDescription: Surface Mount POLY-FUSE® Resettable PTC, 0603L Series; Family: Fuses Resettable; Mounted: Yes; Socket: No; SMD: Yes; Sense: No; Value: 350mA-6V; Manufacturer: LITTELFUSE; Manufacturer Part Number: 0603L035; ComponentHeight: 1.55mm; Author: LNLS DIG LOS; CreateDate: 08/11/2017; LatestRevisionDate: 08/11/2017
IC1 = FM24CL16B-G: 16Kbit (2K x 8) Serial (I2C) F-RAM Memory; Manufacturer: CYPRESS; PressFit: No; Bonding: No; Part Number: FM24CL16B-G; Component Kind: Standard; Component Type: Standard; Device: FM24CL16B-G; PackageDescription: SOIC 8, Pitch 1.27mm - Body 4x5mm, IPC Medium Density; Part Description: 16Kbit (2K x 8) Serial (I2C) F-RAM Memory; Manufacturer Part Number: FM24CL16B-G; Pin Count: 8; Case: SOIC8; Mounted: Yes; Socket: No; SMD: Yes; Sense: No; ComponentHeight: 1.75mm; Author: LNLS DIG LOS; CreateDate: 29/11/2017; LatestRevisionDate: 29/11/2017
IC2 = CP2102-GM: Single-Chip USB to UART Bridge; Manufacturer: SILICON LABS; PressFit: No; Bonding: No; Part Number: CP2102-GM; Component Kind: Standard; Component Type: Standard; Device: CP2102-GM; PackageDescription: QFN, 0.50mm Pitch, Square; 28 pin, 5.00mm L X 5.00mm W X 1.00mm H body (w/thermal tab 3.35 X 3.35mm),  IPC Medium Density; Part Description: Single-Chip USB to UART Bridge; Manufacturer Part Number: CP2102-GM; Pin Count: 29; Case: QFN28; Mounted: Yes; Socket: No; SMD: Yes; Sense: No; ComponentHeight: 1.0mm; Author: CERN DEM JLC; HelpURL: \\cern.ch\dfs\Applications\Altium\Datasheets\CP2102-GM.pdf; CreateDate: 03/03/2011; LatestRevisionDate: 03/03/2011
IC3 = CDCE906PW: PROGRAMMABLE 3-PLL CLOCK SYNTHESIZER / MULTIPLIER / DIVIDER; Manufacturer: TEXAS INSTRUMENTS; PressFit: No; Bonding: No; Part Number: CDCE906PW; Component Kind: Standard; Component Type: Standard; Device: CDCE906PW; PackageDescription: SOP, 20-Leads, Body 6.5x4.4mm, Pitch 0.65mm, IPC Medium Density; Part Description: Programmable 3-PLL clock synthesizer / Multiplier / Divider; Manufacturer Part Number: CDCE906; Pin Count: 20; Case: TSSOP20; Mounted: Yes; Socket: No; SMD: Yes; Sense: No; ComponentHeight: 1.2mm; Author: LNLS DIG LOS; CreateDate: 25/01/2018; LatestRevisionDate: 25/01/2018
IC4 = LM3940IMP-3.3/NOPB: 3-Terminal Regulator 1=IN 2=GND 3=OUT 4=GND; Part Description: 1A Low Dropout Regulator for 5V to 3.3V Conversion; Manufacturer: TEXAS INSTRUMENTS; PressFit: No; Bonding: No; Part Number: LM3940IMP-3.3/NOPB; Component Kind: Standard; Component Type: Standard; Device: LM3940IMP-3.3/NOPB; PackageDescription: SOT223, 2.30mm pitch; 3 pin, 3.70mm W X 6.70mm L, IPC Medium Density; Manufacturer Part Number: LM3940IMP-3.3/NOPB; Pin Count: 4; Case: SOT223; Mounted: Yes; Socket: No; SMD: Yes; Sense: No; ComponentHeight: 1.8mm; Author: CERN DEM JLC; CreateDate: 28/03/2011; LatestRevisionDate: 16/09/2014; HelpURL: \\cern.ch\dfs\Applications\Altium\Datasheets\LM3940IMP-3.3-NOPB.pdf
IC5 = LPC1769FBD100: LPC1768 Series 64kB 120MHz 32-Bit ARM Cortex-M3 Microcontroller; Part Description: 32-bit 120MHz ARM Cortex-M3 Microcontroller, 512kB Flash, 64kB SRAM, with Ethernet, USB 2.0 Host/Device/OTG, CAN; Manufacturer: NXP SEMICONDUCTORS; PressFit: No; Bonding: No; Part Number: LPC1769FBD100; Component Kind: Standard; Component Type: Standard; Device: LPC1769FBD100; PackageDescription: QFP, 0.50mm Pitch, Square; 100 Pin,14.00mm L X 14.00mm W X 1.60mm H Body, IPC Medium Density; Manufacturer Part Number: LPC1769FBD100; Pin Count: 100; Case: QFP100; Mounted: Yes; Socket: No; SMD: Yes; Sense: No; ComponentHeight: 1.6mm; HelpURL: \\cern.ch\dfs\Applications\Altium\Datasheets\LPC1769FBD100.pdf; Author: CERN DEM JLC; CreateDate: 06/10/2016; LatestRevisionDate: 06/10/2016
IC6 = DP83848J_S/ VIAS: DP83848x PHYTER Mini / LS Single Port 10/100 MB/s Ethernet Transceiver; Manufacturer: TEXAS INSTRUMENTS; PressFit: No; Bonding: No; Part Number: DP83848J_S/ VIAS; Component Kind: Standard; Component Type: Standard; Device: DP83848J; PackageDescription: QFN, 0.50mm Pitch, Square 40 pin, 6.00mm L X 6.00mm W X 0.80mm H body (w/thermal tab 4.6mm x 4.6mm), Sem vias, IPC Medium Density; Part Description: DP83848x PHYTER Mini / LS Single Port 10/100 MB/s Ethernet Transceiver; Manufacturer Part Number: DP83848J; Pin Count: 41; Case: 40-WFQFN Exposed Pad; Mounted: Yes; Socket: No; SMD: Yes; Sense: No; ComponentHeight: 0.8mm; Author: LNLS DIG LOS; CreateDate: 27/11/2017; LatestRevisionDate: 27/11/2017
IC7 = SN74AUP1T87DCK: 2-Input Exclusive-NOR Gate; Part Description: Low power, 1.8/2.5/3.3-V input, 3.3-V CMOS output, 2-input exclusive-nor gate; Manufacturer: TEXAS INSTRUMENTS; PressFit: No; Bonding: No; Part Number: SN74AUP1T87DCK; Component Kind: Standard; Component Type: Standard; Device: SN74AUP1T87DCK; PackageDescription: SOT353, SC70-5, SOT, 0.65mm Pitch, 5 pin, 1.25mm W X 2.00mm L X 1.10mm H, IPC Medium Density; Manufacturer Part Number: SN74AUP1T87DCK; Pin Count: 5; Case: SOT23-5; Mounted: Yes; Socket: No; SMD: Yes; Sense: No; ComponentHeight: 1.1mm; Author: LNLS DIG LOS; CreateDate: 26/01/2018; LatestRevisionDate: 26/01/2018
IC8 = SN74LVC1G14DRLR: Single Schmitt-Trigger Inverter; Manufacturer: TEXAS INSTRUMENTS; PressFit: No; Bonding: No; Part Number: SN74LVC1G14DRLR; Component Kind: Standard; Component Type: Standard; Device: SN74LVC1G14DRLR; PackageDescription: SOTFL, 0.50mm, Pitch; 5 Pin, 1.20mm W X 1.60mm L X 0.60mm H Body, IPC Medium Density; Part Description: Single Schmitt-Trigger Inverter; Manufacturer Part Number: SN74LVC1G14DRLR; Pin Count: 5; Case: SOTFL-5; Mounted: Yes; Socket: No; SMD: Yes; Sense: No; ComponentHeight: 0.6mm; Author: CERN DEM JLC; HelpURL: \\cern.ch\dfs\Applications\Altium\Datasheets\SN74LVC1G14DRLR.pdf; CreateDate: 19/11/2014; LatestRevisionDate: 19/11/2014
IC9 = 24AA02E48T-I/OT: 1.7V-5.5V, 2K I2C Serial EEPROM With EUI-48 Node Identity; Manufacturer: MICROCHIP TECHNOLOGY; PressFit: No; Bonding: No; Part Number: 24AA02E48T-I/OT; Component Kind: Standard; Component Type: Standard; Device: 24AA02E48T-I/OT; PackageDescription: SOT, 0.95mm pitch; 5 pin, 1.60mm W X 2.90mm L X 1.45mm H body, IPC Medium Density; Part Description: 1.7V-5.5V, 2K I2C Serial EEPROM With EUI-48 Node Identity; Manufacturer Part Number: 24AA02E48T-I/OT; Pin Count: 5; Case: SOT23-5; Mounted: Yes; Socket: No; SMD: Yes; Sense: No; ComponentHeight: 1.45mm; HelpURL: \\cern.ch\dfs\Applications\Altium\Datasheets\24AA02E48T-I-OT.pdf; Author: CERN DEM MR; CreateDate: 31/03/2016; LatestRevisionDate: 31/03/2016
J1 J2 = TYCO_2-87224-0: Connector 20 Male; Part Description: 20 Contacts, Connector header vertical; Manufacturer: TYCO ELECTRONICS; PressFit: No; Part Number: TYCO_2-87224-0; Component Kind: Standard; Component Type: Standard; Pin Count: 20; Mounted: Yes; Socket: No; SMD: No; Sense: No; Status: None; Manufacturer Part Number: 2-87224-0; ComponentHeight: 13.5mm; Author: LNLS DIG LOS; CreateDate: 16/11/2017; LatestRevisionDate: 16/11/2017
J3 = HIROSE_ZX62D-AB-5P8(30): 5 Pin + 1 Shield USB Receptacle; Part Description: Micro-USB 2.0, SMD Type AB - Standard (Bottom mount), Shell Through Hole; Manufacturer: HIROSE (HRS); PressFit: No; Part Number: HIROSE_ZX62D-AB-5P8(30); Component Kind: Standard; Component Type: Standard; Pin Count: 8; Family: Micro-USB AB 2.0; Mounted: Yes; Socket: No; SMD: Yes; Sense: No; Status: None; Manufacturer Part Number: ZX62D-AB-5P8(30); ComponentHeight: 2.5mm; Author: LNLS DIG LOS; CreateDate: 26/01/2018; LatestRevisionDate: 26/01/2018
J4 = SAMTEC_FTSH-105-01-L-DV-K: Connector 10 Male; Part Description: 10 Contacts, Pitch 1.27mm, Dual Row SMT Micro Header, with keying; Manufacturer: SAMTEC; PressFit: No; Part Number: SAMTEC_FTSH-105-01-L-DV-K; Component Kind: Standard; Component Type: Standard; Pin Count: 10; Family: Header 10; Mounted: Yes; Socket: No; Sense: No; SMD: Yes; Status: None; Manufacturer Part Number: FTSH-105-01-L-DV-K; ComponentHeight: 8.1mm; Author: LNLS DIG LOS; CreateDate: 17/11/2017; LatestRevisionDate: 21/03/2018
L1-L7 = IND0603_MURATA_BLM18AG102SN1D: Inductor; Part Description: SMD EMIFIL Suppression Chip Ferrite Bead; Manufacturer: MURATA; Power: 400mA; Resistance: 0.50R; Tolerance: ±25%; Part Number: IND0603_MURATA_BLM18AG102SN1D; Component Kind: Standard; Component Type: Standard; Pin Count: 2; Value: 1K@100MHz; Status: None; Manufacturer Part Number: BLM18AG102SN1D; Case: 0603; Mounted: Yes; Socket: No; SMD: Yes; Sense: No; ComponentHeight: 0.95mm; Author: LNLS DIG GBMB; CreateDate: 03/11/2017; LatestRevisionDate: 03/11/2017
L8 L9 = IND_MURATA_DLW43MH201XK2: Inductor Common Mode; Part Description: Wire Wound Chip Common Mode Choke Coil (DLW43MH Series); Manufacturer: MURATA; Power: 110mA; Resistance: 4.5R; Tolerance: -25%/+50%; Part Number: IND_MURATA_DLW43MH201XK2; Component Kind: Standard; Component Type: Standard; Pin Count: 4; Value: 200uH; Status: None; Manufacturer Part Number: DLW43MH201XK2; Case: 1812; Mounted: Yes; Socket: No; SMD: Yes; Sense: No; ComponentHeight: 2.7mm; Author: LNLS DIG LOS; CreateDate: 24/01/2018; LatestRevisionDate: 24/01/2018
LD1-LD5 = LED_LITEON_LTST-C150TBKT: LED Blue 1C 2A; Part Description: SMT InGaN Blue LED; Manufacturer: DIALIGHT; PressFit: No; Bonding: No; Part Number: LED_LITEON_LTST-C150TBKT; Component Kind: Standard; Component Type: Standard; Color: Blue; PackageDescription: SMD InGaN Blue LED, 2-Leads, Body 3.2x1.6mm; Manufacturer Part Number: LTST-C150TBKT; Pin Count: 2; Mounted: Yes; Socket: No; SMD: Yes; Sense: No; ComponentHeight: 1.1mm; HelpURL: \\cern.ch\dfs\Applications\Altium\Datasheets\LED_LITEON_LTST-C150TBKT.pdf; Author: CERN DEM JLC; CreateDate: 28/05/2013; LatestRevisionDate: 28/05/2013
MSBOX1 = MSBOX_WURTH_36103205: Metal Screening Box 12 Pins; Part Description: Shielding Cabinet SMD-Frame WE-SHC, Internal Dimensions 20 x 20mm; Manufacturer: WURTH; PressFit: No; Part Number: MSBOX_WURTH_36103205; Component Kind: Standard; Component Type: Standard; Pin Count: 12; PackageDescription: Shielding Cabinet SMD-Frame WE-SHC, Internal Dimensions 20 x 20mm; Mounted: Yes; Socket: No; SMD: Yes; Sense: No; Status: None; Manufacturer Part Number: 36103205; ComponentHeight: 3.1mm; Author: LNLS DIG LOS; CreateDate: 22/11/2017; LatestRevisionDate: 22/11/2017
MSBOX2 = MSBOX_WURTH_36003200: Metal Screening Box - Top Cover 0 Pin; Part Description: Top Cover For 20 x 20mm WE-SHC Shielding Cabinet; Manufacturer: WURTH; PressFit: No; Part Number: MSBOX_WURTH_36003200; Component Kind: Standard; Component Type: Standard; Pin Count: 0; PackageDescription: Top Cover For 20 x 20mm WE-SHC Shielding Cabinet; Mounted: Yes; Socket: No; SMD: No; Sense: No; Status: None; Manufacturer Part Number: 36003200; ComponentHeight: 3.1mm; Author: LNLS DIG LOS; CreateDate: 22/11/2017; LatestRevisionDate: 22/11/2017
OSC2 = ASE-12-D-C-T: Oscillator 4 pins 1=STBY 2=GND 3=OUT 4=Vdd; Part Description: 3.3V CMOS SMD Crystal Oscillator; Manufacturer: ABRACON CORPORATION; PressFit: No; Bonding: No; Part Number: ASE-12-D-C-T; Component Kind: Standard; Component Type: Standard; PackageDescription: 4 Pins, 2.5x3.2mm, SMD Sealing Crystal, CS Serie; Value: 12MHz; Manufacturer Part Number: ASE-12-D-C-T; Pin Count: 4; Mounted: Yes; Socket: No; SMD: Yes; Sense: No; ComponentHeight: 1.2mm; Author: LNLS DIG LOS; CreateDate: 31/07/2017; LatestRevisionDate: 31/07/2017
PB1 = PB_OMRON_B3U-1100P: Push-Button Switch SPDT; Part Description: 3x2.5mm Ultra-Small Tactile SPST Pushbutton Switch (with Ground Terminal),Contact Rating 50mA 12VDC, B3U Serie; Manufacturer: OMRON; PressFit: No; Part Number: PB_OMRON_B3U-1100P; Component Kind: Standard; Component Type: Standard; Pin Count: 3; PackageDescription: Body 1.2x3x2.5mm Ultra-Small Tactile SPST Pushbutton Switch, (with Ground Terminal), OMRON B3U Series; Family: Push Button; Mounted: Yes; Socket: No; SMD: Yes; Sense: No; Status: None; Manufacturer Part Number: PB_OMRON_B3U-1100P; ComponentHeight: 1.75mm; HelpURL: \\cern.ch\dfs\Applications\Altium\Datasheets\PB_OMRON_B3U-1100P.pdf; Author: CERN DEM JLC; CreateDate: 16/03/2010; LatestRevisionDate: 16/03/2010
Q1 = XTAL_32.768KHZ_ABRACON_ABS06-32.768KHZ-9: Quartz Crystal; Part Description: Tolerance: ±20ppm, -40°C to +85°C, 9pF, SMD Low Profile Crystal, ABS06 Series; PressFit: No; Bonding: No; Part Number: XTAL_32.768KHZ_ABRACON_ABS06-32.768KHZ-9; Component Kind: Standard; Component Type: Standard; PackageDescription: 2 Pins, 2.15x1.3mm, SMD Low Profile Crystal, ABS06 Series; Value: 32.768kHz; Manufacturer: ABRACON; Manufacturer Part Number: ABS06-32.768kHz-9; Pin Count: 2; Mounted: Yes; Socket: No; SMD: Yes; Sense: No; ComponentHeight: 0.6mm; HelpURL: \\cern.ch\dfs\Applications\Altium\Datasheets\XTAL_ABRACON_ABS06.pdf; Author: CERN DEM JMW; CreateDate: 12/08/2015; LatestRevisionDate: 12/08/2015
R1-R4 R7-R10 R26-R32 R35 R36 R39 R44 R45 R48 = R0402_2K2_1%_0.0625W_100PPM: Resistor - 1%; Part Description: General Purpose Thick Film Chip Resistor; Manufacturer: GENERIC; Manufacturer1 Part Number: 232270672202L; TC: ±100ppm/°C; Part Number: R0402_2K2_1%_0.0625W_100PPM; Component Kind: Standard; Component Type: Standard; Pin Count: 2; Value: 2k2; Status: Not recommended; Power: 0.0625W; Tolerance: ±1%; Manufacturer Part Number: R0402_2K2_1%_0.0625W_100PPM; Case: 0402; Mounted: Yes; Sense: No; Socket: No; SMD: Yes; Manufacturer1 Example: YAGEO PHYCOMP; Manufacturer1 ComponentHeight: 0.4mm; HelpURL: \\cern.ch\dfs\Applications\Altium\Datasheets\R0402_Phycomp_RC0402.pdf; Author: CERN DEM JLC; CreateDate: 03/12/2007; LatestRevisionDate: 17/10/2012
R5 R6 R17 R18 = R0402_33R_1%_0.0625W_100PPM: Resistor - 1%; Part Description: General Purpose Thick Film Chip Resistor; Manufacturer: GENERIC; Manufacturer1 Part Number: 232270673309L; TC: ±100ppm/°C; Part Number: R0402_33R_1%_0.0625W_100PPM; Component Kind: Standard; Component Type: Standard; Pin Count: 2; Value: 33; Status: Not recommended; Power: 0.0625W; Tolerance: ±1%; Manufacturer Part Number: R0402_33R_1%_0.0625W_100PPM; Case: 0402; Mounted: Yes; Sense: No; Socket: No; SMD: Yes; Manufacturer1 Example: YAGEO PHYCOMP; Manufacturer1 ComponentHeight: 0.4mm; HelpURL: \\cern.ch\dfs\Applications\Altium\Datasheets\R0402_Phycomp_RC0402.pdf; Author: CERN DEM JLC; CreateDate: 03/12/2007; LatestRevisionDate: 17/10/2012
R11-R13 R15 R16 R33 R40-R43 = R0402_49R9_1%_0.0625W_100PPM: Resistor - 1%; Part Description: General Purpose Thick Film Chip Resistor; Manufacturer: GENERIC; Manufacturer1 Part Number: 232270674999L or RC0402FR-0749R9L; TC: ±100ppm/°C; Part Number: R0402_49R9_1%_0.0625W_100PPM; Component Kind: Standard; Component Type: Standard; Pin Count: 2; Value: 49R9; Status: Not recommended; Power: 0.0625W; Tolerance: ±1%; Manufacturer Part Number: R0402_49R9_1%_0.0625W_100PPM; Case: 0402; Mounted: Yes; Sense: No; Socket: No; SMD: Yes; Manufacturer1 Example: YAGEO PHYCOMP; Manufacturer1 ComponentHeight: 0.4mm; HelpURL: \\cern.ch\dfs\Applications\Altium\Datasheets\R0402_Phycomp_RC0402.pdf; Author: CERN DEM JLC; CreateDate: 24/10/2012; LatestRevisionDate: 24/10/2012
R14 = R0402_4K87_1%_0.0625W_100PPM: Resistor - 1%; Part Description: General Purpose Thick Film Chip Resistor; Manufacturer: GENERIC; Manufacturer1 Part Number: CRCW04024K87FKED; TC: ±100ppm/°C; Part Number: R0402_4K87_1%_0.0625W_100PPM; Component Kind: Standard; Component Type: Standard; Pin Count: 2; Value: 4k87; Status: None; Power: 0.0625W; Tolerance: ±1%; Manufacturer Part Number: R0402_4K87_1%_0.0625W_100PPM; Case: 0402; Mounted: Yes; Sense: No; Socket: No; SMD: Yes; Manufacturer1 Example: VISHAY; Manufacturer1 ComponentHeight: 0.4mm; HelpURL: \\cern.ch\dfs\Applications\Altium\Datasheets\R0402_VISHAY_CRCW e3.pdf; Author: CERN DEM JLC; CreateDate: 04/11/2014; LatestRevisionDate: 04/11/2014
R19 = R0402_1K5_1%_0.0625W_100PPM: Resistor - 1%; Part Description: General Purpose Thick Film Chip Resistor; Manufacturer: GENERIC; Manufacturer1 Part Number: 232270671502L; TC: ±100ppm/°C; Part Number: R0402_1K5_1%_0.0625W_100PPM; Component Kind: Standard; Component Type: Standard; Pin Count: 2; Value: 1k5; Status: Not recommended; Power: 0.0625W; Tolerance: ±1%; Manufacturer Part Number: R0402_1K5_1%_0.0625W_100PPM; Case: 0402; Mounted: Yes; Sense: No; Socket: No; SMD: Yes; Manufacturer1 Example: YAGEO PHYCOMP; Manufacturer1 ComponentHeight: 0.4mm; HelpURL: \\cern.ch\dfs\Applications\Altium\Datasheets\R0402_Phycomp_RC0402.pdf; Author: CERN DEM JLC; CreateDate: 03/12/2007; LatestRevisionDate: 17/10/2012
R20 = R0402_10K_1%_0.0625W_100PPM: Resistor - 1%; Part Description: General Purpose Thick Film Chip Resistor; Manufacturer: GENERIC; Manufacturer1 Part Number: 232270671003L; TC: ±100ppm/°C; Part Number: R0402_10K_1%_0.0625W_100PPM; Component Kind: Standard; Component Type: Standard; Pin Count: 2; Value: 10k; Status: Not recommended; Power: 0.0625W; Tolerance: ±1%; Manufacturer Part Number: R0402_10K_1%_0.0625W_100PPM; Case: 0402; Mounted: Yes; Sense: No; Socket: No; SMD: Yes; Manufacturer1 Example: YAGEO PHYCOMP; Manufacturer1 ComponentHeight: 0.4mm; HelpURL: \\cern.ch\dfs\Applications\Altium\Datasheets\R0402_Phycomp_RC0402.pdf; Author: CERN DEM JLC; CreateDate: 03/12/2007; LatestRevisionDate: 17/10/2012
R21-R25 = R0402_220R_1%_0.0625W_100PPM: Resistor - 1%; Part Description: General Purpose Thick Film Chip Resistor; Manufacturer: GENERIC; Manufacturer1 Part Number: 232270672201L; TC: ±100ppm/°C; Part Number: R0402_220R_1%_0.0625W_100PPM; Component Kind: Standard; Component Type: Standard; Pin Count: 2; Value: 220; Status: Not recommended; Power: 0.0625W; Tolerance: ±1%; Manufacturer Part Number: R0402_220R_1%_0.0625W_100PPM; Case: 0402; Mounted: Yes; Sense: No; Socket: No; SMD: Yes; Manufacturer1 Example: YAGEO PHYCOMP; Manufacturer1 ComponentHeight: 0.4mm; HelpURL: \\cern.ch\dfs\Applications\Altium\Datasheets\R0402_Phycomp_RC0402.pdf; Author: CERN DEM JLC; CreateDate: 03/12/2007; LatestRevisionDate: 17/10/2012
R49 R50 = R0402_1K_1%_0.0625W_100PPM: Resistor - 1%; Part Description: General Purpose Thick Film Chip Resistor; Manufacturer: GENERIC; Manufacturer1 Part Number: 232270671002L; TC: ±100ppm/°C; Part Number: R0402_1K_1%_0.0625W_100PPM; Component Kind: Standard; Component Type: Standard; Pin Count: 2; Value: 1k; Status: Not recommended; Power: 0.0625W; Tolerance: ±1%; Manufacturer Part Number: R0402_1K_1%_0.0625W_100PPM; Case: 0402; Mounted: Yes; Sense: No; Socket: No; SMD: Yes; Manufacturer1 Example: YAGEO PHYCOMP; Manufacturer1 ComponentHeight: 0.4mm; HelpURL: \\cern.ch\dfs\Applications\Altium\Datasheets\R0402_Phycomp_RC0402.pdf; Author: CERN DEM JLC; CreateDate: 03/12/2007; LatestRevisionDate: 17/10/2012
SW1 = SW_TYCO_1571983-4: 4 Ways SPST DIP Switch; Part Description: 4 Way SPST SMD DIP Switch, Latched, Contact Rating 0.025A 24VDC; Manufacturer: TYCO; Manufacturer Part Number: 1571983-4 or GDH04S04; PressFit: No; Part Number: SW_TYCO_1571983-4; Component Kind: Standard; Component Type: Standard; Pin Count: 8; PackageDescription: Pitch 1.27mm,  Body 6.2x6.2mm, 4 Ways SPST Surface-Mount DIP Switch, TYCO GDH Serie; Family: Switch; Mounted: Yes; Socket: No; SMD: Yes; Sense: No; Status: None; ComponentHeight: 2.31mm; HelpURL: \\cern.ch\dfs\Applications\Altium\Datasheets\SW_TYCO_1571983-4.pdf; Author: CERN DEM JLC; CreateDate: 08/01/2009; LatestRevisionDate: 08/01/2009
T1 = BSS84AK: 50V, 180mA P-Channel Trench MOSFET; Part Description: 50V, 180mA P-channel Trench MOSFET Transistor; Manufacturer: NXP SEMICONDUCTORS; PressFit: No; Bonding: No; Part Number: BSS84AK; Component Kind: Standard; Component Type: Standard; Device: BSS84AK; PackageDescription: SOT23, 3 pin, Pitch 0.95mm - 1.3mm W X 2.9mm L X 1.1mm H, IPC Medium Density; Manufacturer Part Number: BSS84AK; Pin Count: 3; Case: SOT23-3; Mounted: Yes; Socket: No; SMD: Yes; Sense: No; ComponentHeight: 1.1mm; HelpURL: \\cern.ch\dfs\Applications\Altium\Datasheets\BSS84AK.pdf; Author: CERN DEM JLC; CreateDate: 16/04/2015; LatestRevisionDate: 16/04/2015
TP1-TP8 = SMD_PAD_1.20_d_MM: Test Point; Part Description: 1.20mm diameter SMD Test Point Area; Mounted: No; Part Number: SMD_PAD_1.20_d_MM; Component Kind: Standard (No BOM); Component Type: Standard (No BOM); Pin Count: 1; Family: Test Point; Socket: No; SMD: Yes; Sense: No; Status: None; ComponentHeight: 0mm; HelpURL: Undefined; Author: LNLS DIG GBMB; CreateDate: 31/05/2016; LatestRevisionDate: 31/05/2016; PackageDescription: 1.20mm diameter SMD Test Point Area